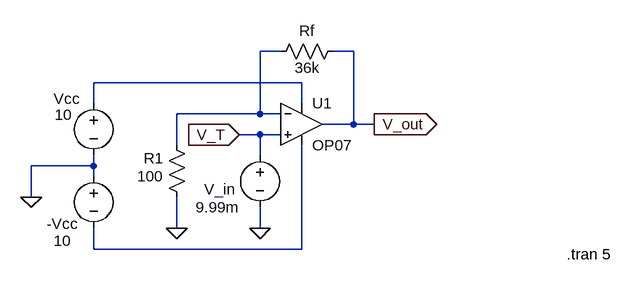
[diagram p0: schematic op_amp.asc]
op_amp.asc, the LTspice schematic file:
Version 4
SHEET 1 880 680
WIRE 64 32 32 32
WIRE 176 32 144 32
WIRE 96 80 -224 80
WIRE -224 112 -224 80
WIRE 96 112 96 80
WIRE 32 128 32 32
WIRE 32 128 -96 128
WIRE 64 128 32 128
WIRE 176 144 176 32
WIRE 176 144 128 144
WIRE 208 144 176 144
WIRE 32 160 0 160
WIRE 64 160 32 160
WIRE -96 176 -96 128
WIRE 32 192 32 160
WIRE -224 208 -224 192
WIRE -224 208 -320 208
WIRE -224 224 -224 208
WIRE -320 256 -320 208
WIRE -96 304 -96 256
WIRE 32 304 32 272
WIRE -224 336 -224 304
WIRE 96 336 96 176
WIRE 96 336 -224 336
FLAG -96 304 0
FLAG 32 304 0
FLAG 208 144 V_out
IOPIN 208 144 Out
FLAG -320 256 0
FLAG 0 160 V_T
IOPIN 0 160 In
SYMBOL res 160 16 R90
WINDOW 0 0 56 VBottom 2
WINDOW 3 57 55 VBottom 2
SYMATTR InstName Rf
SYMATTR Value 36k
SYMBOL res -80 272 R180
WINDOW 0 36 76 Left 2
WINDOW 3 36 48 Left 2
SYMATTR InstName R1
SYMATTR Value 100
SYMBOL voltage 32 176 R0
WINDOW 0 -86 68 Left 2
WINDOW 3 -99 96 Left 2
WINDOW 123 0 0 Left 0
WINDOW 39 0 0 Left 0
SYMATTR InstName V_in
SYMATTR Value 9.99m
SYMBOL OpAmps\\OP07 96 80 R0
SYMATTR InstName U1
SYMBOL voltage -224 96 R0
WINDOW 0 -61 9 Left 2
WINDOW 3 -60 33 Left 2
WINDOW 123 0 0 Left 0
WINDOW 39 0 0 Left 0
SYMATTR InstName Vcc
SYMATTR Value 10
SYMBOL voltage -224 208 R0
WINDOW 0 -72 89 Left 2
WINDOW 3 -61 115 Left 2
WINDOW 123 0 0 Left 0
WINDOW 39 0 0 Left 0
SYMATTR InstName -Vcc
SYMATTR Value 10
TEXT 504 344 Left 2 !.tran 5

The netlist it stands for:
* op_amp.asc
Rf V_out N001 36k
R1 0 N001 100
V_in V_T 0 9.99m
XU1 V_T N001 N002 N003 V_out LT1001  ; OP07, pins In+ In- V+ V- OUT
Vcc N002 0 10
V§-Vcc 0 N003 10
.tran 5
.lib LTC.lib
.backanno
.end